# EAGLE design toaster-orig (EAGLE 5.04)
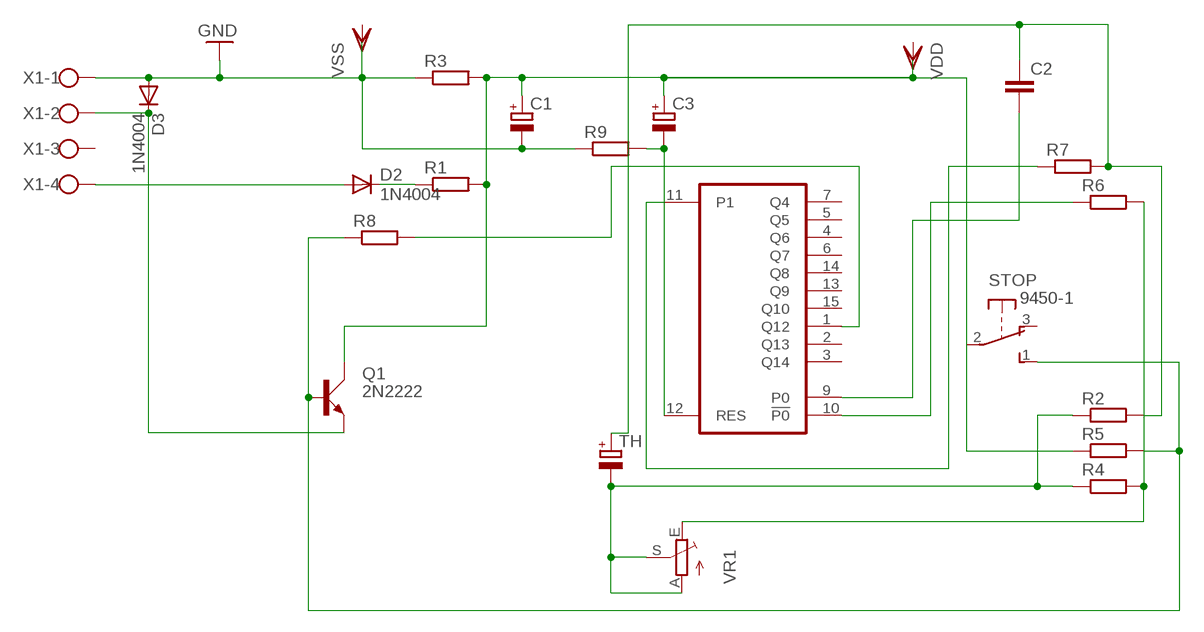
[diagram p0: schematic, sheet 1]

## Parts
C1  CPOL-EU085CS-1AR  [085CS_1AR]
C2  C-EU025-024X044  [C025-024X044]
C3  CPOL-EU085CS-1AR  [085CS_1AR]
D2  1N4004  [DO41-10]
D3  1N4004  [DO41-10]
Q1  2N2222  [TO18A]
R1  R-EU_0204/5  [0204/5]
R2  R-EU_0204/5  [0204/5]
R3  R-EU_0204/5  [0204/5]
R4  R-EU_0204/5  [0204/5]
R5  R-EU_0204/5  [0204/5]
R6  R-EU_0204/5  [0204/5]
R7  R-EU_0204/5  [0204/5]
R8  R-EU_0204/5  [0204/5]
R9  R-EU_0204/5  [0204/5]
STOP  9450-1  [9450-1]
TH  CPOL-EU085CS-1AR  [085CS_1AR]
U1  4060N  [DIL16]
VR1  TRIM_EU-CIP20C-6MM  [CIP20C-6MM]
X1  W237-04P  [W237-4P]

## Nets
GND: C1.- D3.A R3.1 R9.1 X1.1
N$2: D3.C Q1.E X1.2
N$3: D2.A X1.4
N$4: D2.C R1.1
N$6: R2.1 R4.1 TH.- VR1.A VR1.S
N$7: R8.2 U1.1(Q12)
N$8: C3.- R9.2 U1.12(RES)
N$9: R4.2 R6.2 VR1.E
N$10: C1.+ C3.+ Q1.C R1.2 R3.2 R5.1 STOP.2(P)
N$11: C2.1 R2.2 R7.2 TH.+
N$14: Q1.B R5.2 R8.1 STOP.1(S)
N$15: R7.1 U1.11(P1)
N$16: R6.1 U1.10(!P0)
N$17: C2.2 U1.9(P0)
Unconnected: STOP.3(O) U1.2(Q13) U1.3(Q14) U1.4(Q6) U1.5(Q5) U1.6(Q7) U1.7(Q4) U1.13(Q9) U1.14(Q8) U1.15(Q10) X1.3

## Power pins joined to a net without a drawn wire
VDD: U1.16(VDD)
VSS: U1.8(VSS)

## Library data of the parts
C1 C3 TH = rcl:CPOL-EU: POLARIZED CAPACITOR, European symbol
C2 = rcl:C-EU: CAPACITOR, European symbol
D2 D3 = diode:1N4004: DIODE general purpose rectifier, 1 A
Q1 = transistor-small-signal:2N2222: NPN TRANSISTOR
R1-R9 = rcl:R-EU_: RESISTOR, European symbol
STOP = switch-misc:9450-1: MARQUARDT SWITCH
U1 = 40xx:4060: 14-stage binary/ripple COUNTER
VR1 = pot:TRIM_EU-: POTENTIOMETER
X1 = con-wago-508:W237-04P: WAGO SREW CLAMP

## Board
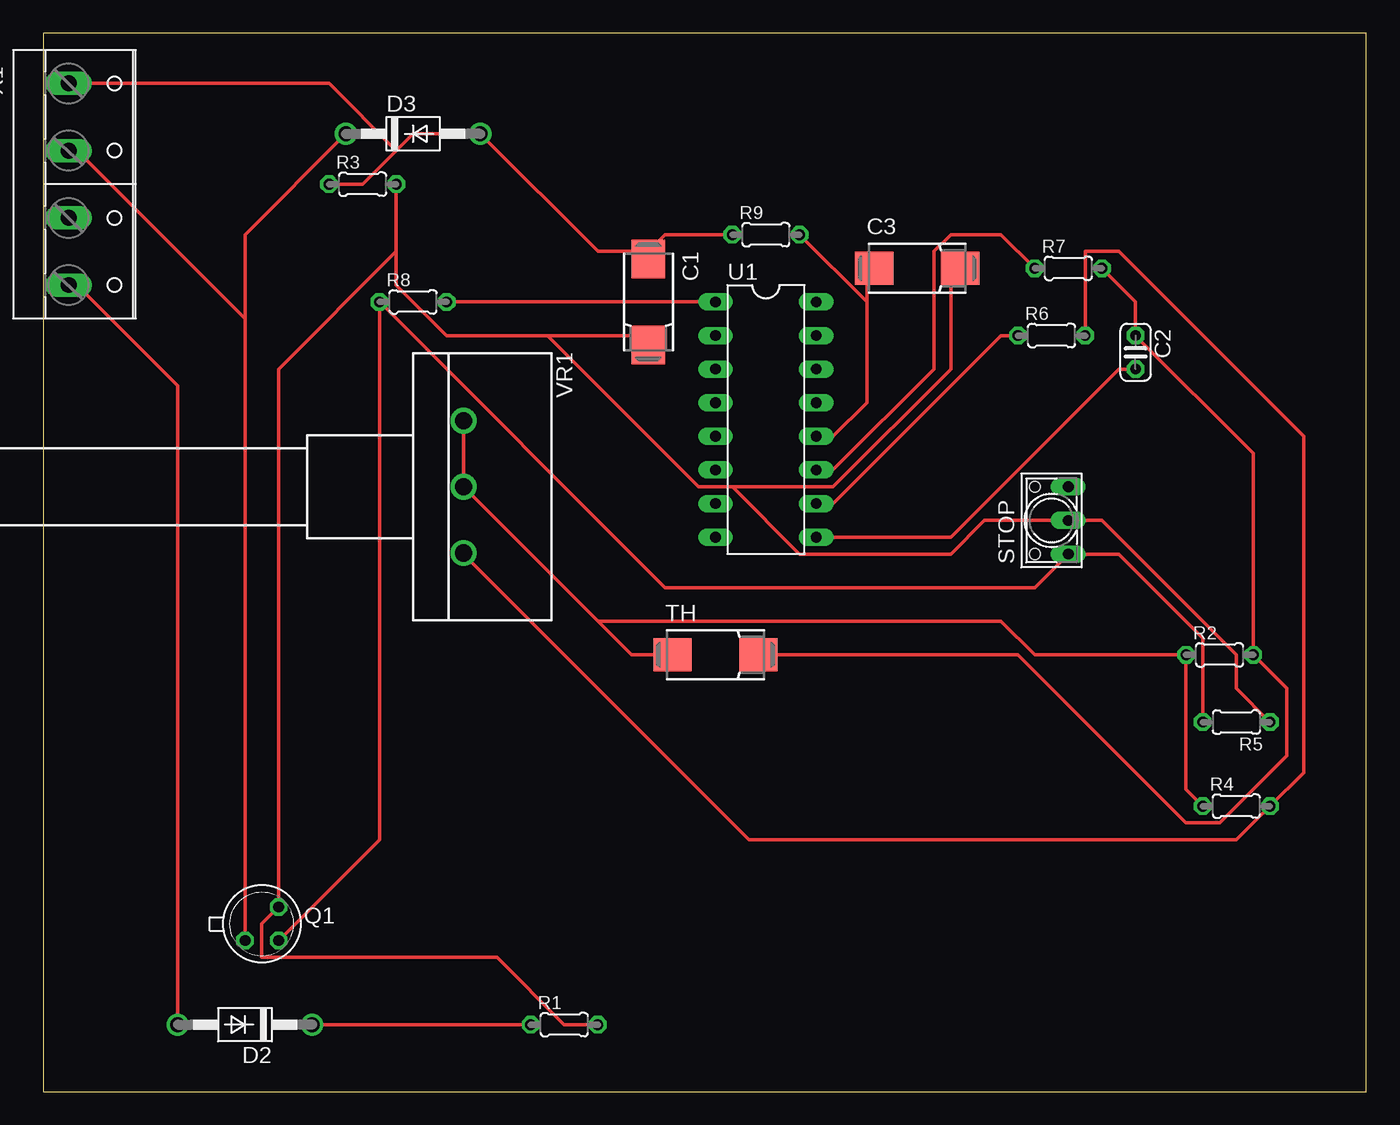
[diagram p1: board, top side]

Size 100 x 80 mm. Coordinates in mm from the lower left corner, seen from the top.
Outline: 0,0 100,0 100,80 0,80 0,0
Copper layers (1*16): Top 0.035mm / dielectric 1.5mm / Bottom 0.035mm
Design rules "default": minimum track width 10mil, minimum drill 24mil, track to track 8mil, track to pad 8mil, pad to pad 8mil, via to via 8mil, smd to smd 8mil, copper to edge 40mil, drill to drill 8mil, minimum pad ring 10mil, minimum via ring 8mil, stop-mask expansion 4mil, vias tented up to drill 0mil, thermal gap 10mil

### Footprints (pad centres in the part's own frame; a part is rotated, then mirrored left to right if it is on the bottom)
085CS_1AR = smd 2.9 x 2.5: + 3.25,0; - -3.25,0
C025-024X044 = drill 0.813 octagon: 1 -1.27,0; 2 1.27,0
DO41-10 = drill 1.118 round: A 5.08,0; C -5.08,0
TO18A = drill 0.813 octagon: B 1.27,-1.27; C 1.27,1.27; E -1.27,-1.27
0204/5 = drill 0.813 octagon: 1 -2.54,0; 2 2.54,0
9450-1 = drill 0.813 long: 1 -2.54,-1.27; 2 0,-1.27; 3 2.54,-1.27 | hole 0.813: 2.54,1.27; -2.54,1.27
DIL16 = drill 0.813 long: 1 -8.89,-3.81; 2 -6.35,-3.81; 3 -3.81,-3.81; 4 -1.27,-3.81; 5 1.27,-3.81; 6 3.81,-3.81; 7 6.35,-3.81; 8 8.89,-3.81; 9 8.89,3.81; 10 6.35,3.81; 11 3.81,3.81; 12 1.27,3.81; 13 -1.27,3.81; 14 -3.81,3.81; 15 -6.35,3.81; 16 -8.89,3.81
CIP20C-6MM = drill 1.3 pad 1.93 round: A -5,0; E 5,0; S 0,0
W237-4P = drill 1.194 long: 1 -7.62,-0.635; 2 -2.54,-0.635; 3 2.54,-0.635; 4 7.62,-0.635

### Placement (x,y rotation side)
C1  45.72,59.69 270 top
C2  82.55,55.88 270 top
C3  66.04,62.23 0 top
D2  15.24,5.08 180 top
D3  27.94,72.39 0 top
Q1  16.51,12.7 0 top
R1  39.37,5.08 0 top
R2  88.9,33.02 0 top
R3  24.13,68.58 0 top
R4  90.17,21.59 0 top
R5  90.17,27.94 180 top
R6  76.2,57.15 0 top
R7  77.47,62.23 0 top
R8  27.94,59.69 0 top
R9  54.61,64.77 0 top
STOP  76.2,43.18 90 top
TH  50.8,33.02 0 top
U1  54.61,50.8 270 top
VR1  31.75,45.72 270 top
X1  2.54,68.58 270 top

### Tracks (layer width: path | path; a pad name or v marks a point on that pad's centre or on a via)
GND
  Top 0.254: R9.1 46.99,64.77 45.72,63.5 | R3.1 24.13,68.58 26.67,71.12 | 26.67,71.12 27.94,72.39 D3.A 41.91,63.5 45.72,63.5 | 26.67,71.12 21.59,76.2 X1.1 | 45.72,63.5 C1.-
N$2
  Top 0.254: 15.24,58.42 15.24,64.77 D3.C | Q1.E 15.24,58.42 | 15.24,58.42 2.54,71.12 X1.2
N$3
  Top 0.254: D2.A 10.16,53.34 2.54,60.96 X1.4
N$4
  Top 0.254: D2.C R1.1
N$6
  Top 0.254: R4.1 86.36,22.86 R2.1 74.93,33.02 72.39,35.56 41.91,35.56 | 41.91,35.56 VR1.S VR1.A 31.75,50.8 | 41.91,35.56 44.45,33.02 TH.-
N$7
  Top 0.254: R8.2 U1.1
N$8
  Top 0.254: 62.23,59.69 62.23,62.23 C3.- | 62.23,59.69 62.23,52.07 59.69,49.53 U1.12 | 62.23,59.69 R9.2
N$9
  Top 0.254: VR1.E 31.75,40.64 53.34,19.05 90.17,19.05 R4.2 95.25,24.13 95.25,49.53 81.28,63.5 78.74,63.5 R6.2
N$10
  Top 0.254: R1.2 39.37,5.08 34.29,10.16 16.51,10.16 16.51,12.7 Q1.C 17.78,54.61 26.67,63.5 | R5.1 90.17,30.48 90.17,33.02 80.01,43.18 STOP.2 71.12,43.18 68.58,40.64 57.15,40.64 52.07,45.72 | 26.67,63.5 26.67,60.96 30.48,57.15 38.1,57.15 | 26.67,63.5 R3.2 | 38.1,57.15 45.72,57.15 C1.+ | 52.07,45.72 49.53,45.72 38.1,57.15 | 52.07,45.72 59.69,45.72 68.58,54.61 68.58,62.23 C3.+
N$11
  Top 0.254: R7.2 82.55,59.69 C2.1 91.44,48.26 R2.2 93.98,30.48 93.98,25.4 88.9,20.32 86.36,20.32 73.66,33.02 TH.+
N$14
  Top 0.254: R5.2 87.63,34.29 81.28,40.64 STOP.1 74.93,38.1 46.99,38.1 R8.1 25.4,19.05 Q1.B
N$15
  Top 0.254: R7.1 72.39,64.77 68.58,64.77 67.31,63.5 67.31,54.61 59.69,46.99 U1.11
N$16
  Top 0.254: R6.1 72.39,57.15 59.69,44.45 U1.10
N$17
  Top 0.254: C2.2 81.28,54.61 68.58,41.91 U1.9